# EAGLE schematic Kammsensor (EAGLE 7.7.0)
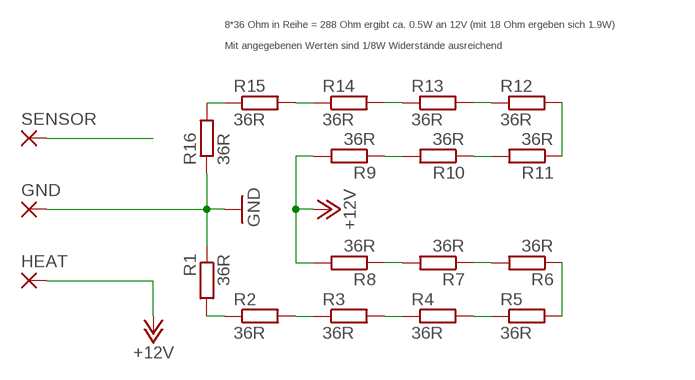
[diagram p0: schematic, sheet 1]

## Parts
GND  WIREPADSMD5-1,8  [5-1,8]
HEAT  WIREPADSMD5-1,8  [5-1,8]
R1  36R  R-EU_M1206  [M1206]
R2  36R  R-EU_M1206  [M1206]
R3  36R  R-EU_M1206  [M1206]
R4  36R  R-EU_M1206  [M1206]
R5  36R  R-EU_M1206  [M1206]
R6  36R  R-EU_M1206  [M1206]
R7  36R  R-EU_M1206  [M1206]
R8  36R  R-EU_M1206  [M1206]
R9  36R  R-EU_M1206  [M1206]
R10  36R  R-EU_M1206  [M1206]
R11  36R  R-EU_M1206  [M1206]
R12  36R  R-EU_M1206  [M1206]
R13  36R  R-EU_M1206  [M1206]
R14  36R  R-EU_M1206  [M1206]
R15  36R  R-EU_M1206  [M1206]
R16  36R  R-EU_M1206  [M1206]
SENSOR  WIREPADSMD5-1,8  [5-1,8]

## Nets
+12V: HEAT.1(P) R8.2 R9.2
GND: GND.1(P) R1.1 R16.1
N$1: R3.2 R4.1
N$2 [PWR]: R2.2 R3.1
N$3: R14.1 R15.2
N$4: R4.2 R5.1
N$5: R5.2 R6.1
N$6: R6.2 R7.1
N$7 [PWR]: R1.2 R2.1
N$8: R7.2 R8.1
N$9: R9.1 R10.2
N$11: R10.1 R11.2
N$12: R11.1 R12.2
N$13: R12.1 R13.2
N$14: R13.1 R14.2
N$15: R15.1 R16.2
SENSOR: SENSOR.1(P)

## Notes on the sheet
- 8*36 Ohm in Reihe = 288 Ohm ergibt ca. 0.5W an 12V (mit 18 Ohm ergeben sich 1.9W)
  
  Mit angegebenen Werten sind 1/8W Widerstände ausreichend

## Library data of the parts
GND HEAT SENSOR = wirepad:WIREPAD: Wire PAD connect wire on PCB
R1-R16 = rcl:R-EU_: RESISTOR, European symbol

## Net classes
0 default: width 0.305 mm
1 PWR: width 0.61 mm